# EAGLE design EMGrealPart2w1 (EAGLE 9.3.1)

## Sheet 1 of 2
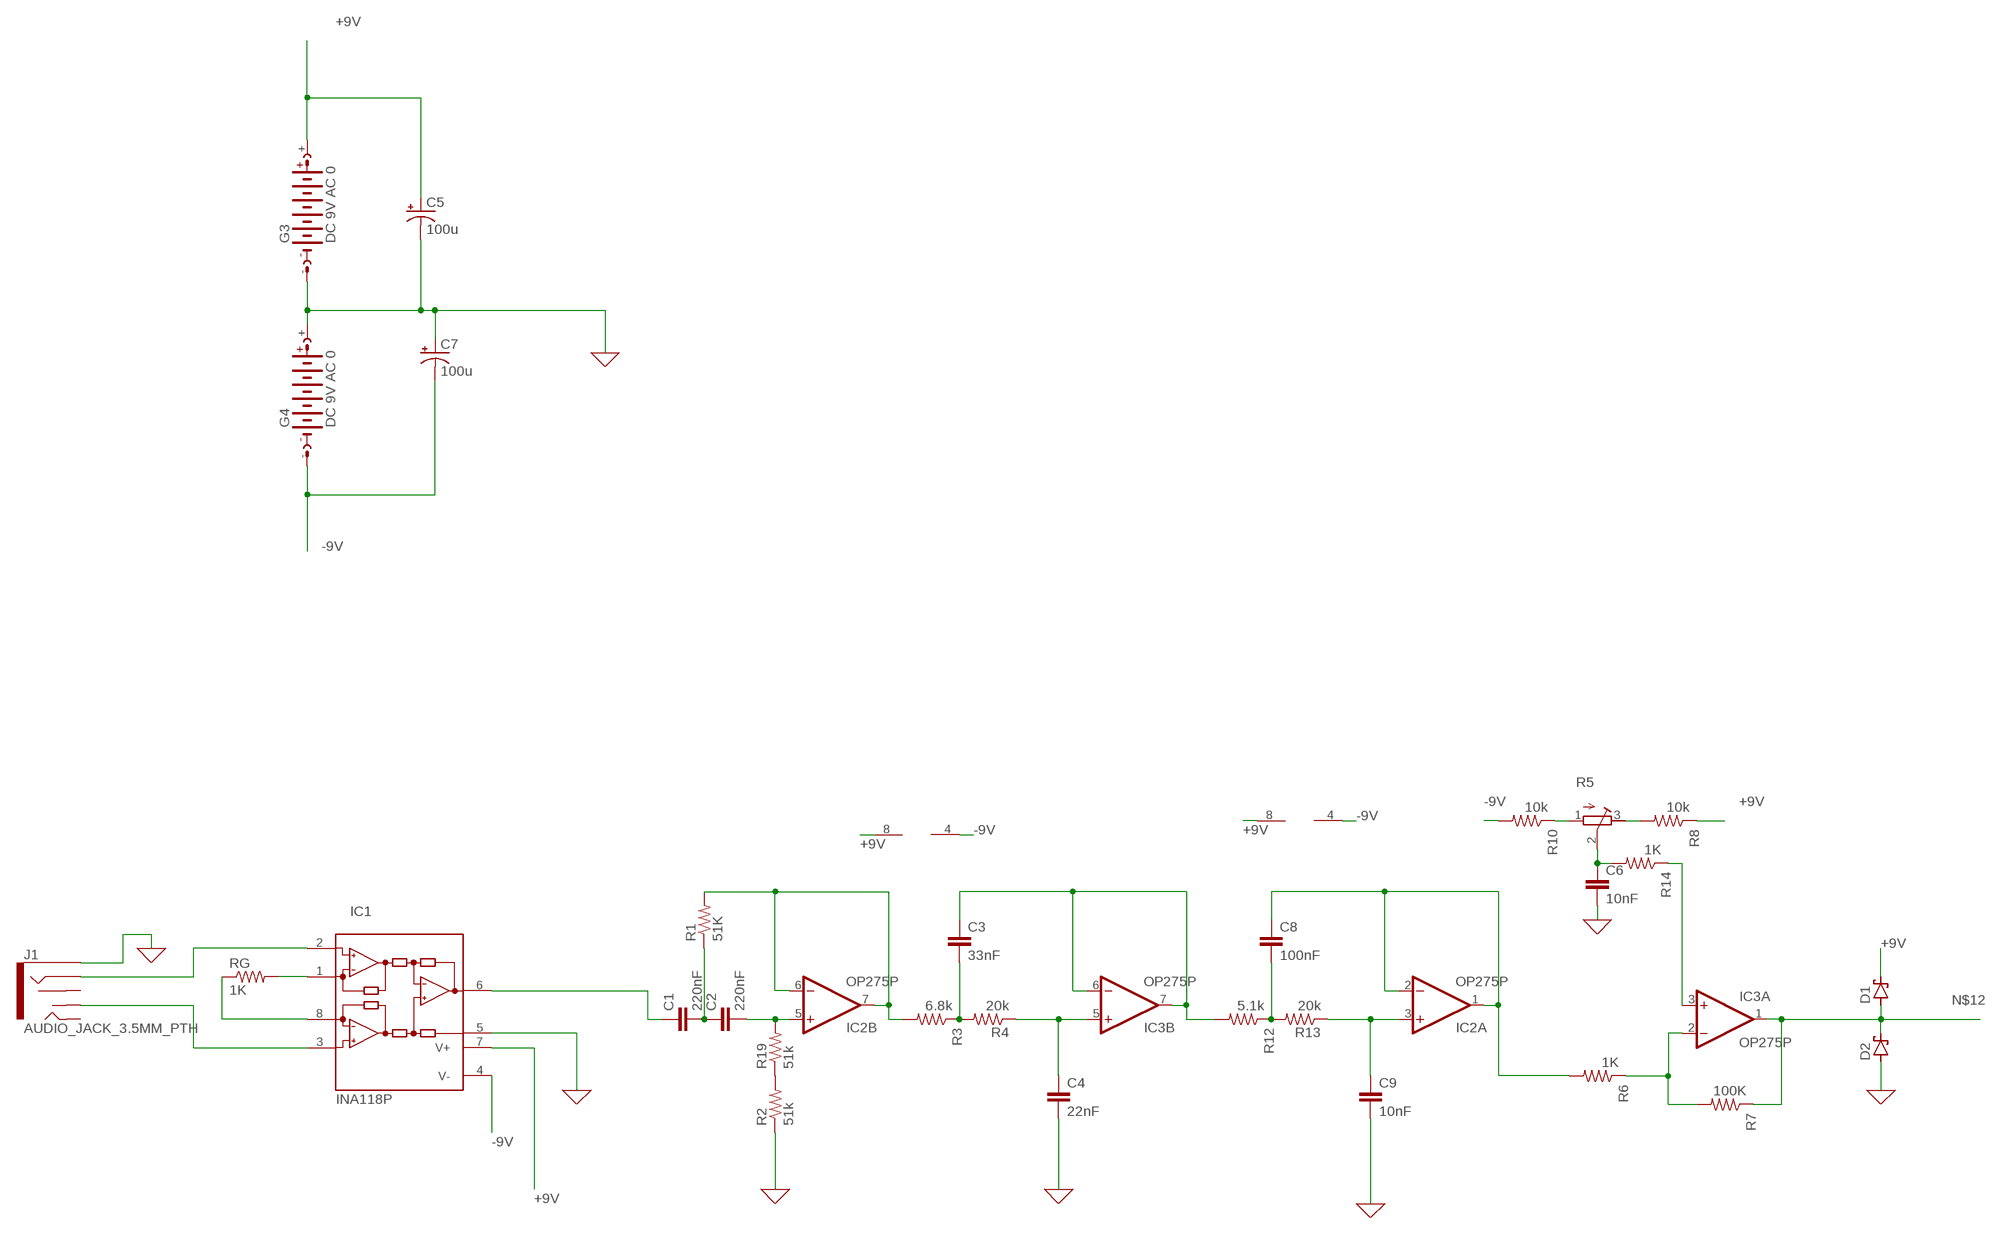
[diagram p0: schematic, sheet 1]

### Parts
C1  220nF  C-EU050-025X075  [C050-025X075]
C2  220nF  C-EU050-025X075  [C050-025X075]
C3  33nF  C-EU050-025X075  [C050-025X075]
C4  22nF  C-EU050-025X075  [C050-025X075]
C5  100u  CPOL-USE2.5-6  [E2,5-6]
C6  10nF  C-EU050-025X075  [C050-025X075]
C7  100u  CPOL-USE2.5-6  [E2,5-6]
C8  100nF  C-EU050-025X075  [C050-025X075]
C9  10nF  C-EU050-025X075  [C050-025X075]
D1  SCHOTTKY-DIODEF126Z12  [F126Z12]
D2  SCHOTTKY-DIODEF126Z12  [F126Z12]
G3  DC 9V AC 0  AB9V  [AB9V]
G4  DC 9V AC 0  AB9V  [AB9V]
IC1  INA118P  [DIL08]
IC2  OP275P  [DIL08]
IC3  OP275P  [DIL08]
J1  AUDIO_JACK_3.5MM_PTH  [AUDIO-JACK]
R1  51K  R-US_0207/12  [0207/12]
R2  51k  R-US_0207/12  [0207/12]
R3  6.8k  R-US_0207/12  [0207/12]
R4  20k  R-US_0207/12  [0207/12]
R5  R-TRIMM64W  [RTRIM64W]
R6  1K  R-US_0207/12  [0207/12]
R7  100K  R-US_0207/12  [0207/12]
R8  10k  R-US_0207/12  [0207/12]
R10  10k  R-US_0207/12  [0207/12]
R12  5.1k  R-US_0207/12  [0207/12]
R13  20k  R-US_0207/12  [0207/12]
R14  1K  R-US_0207/12  [0207/12]
R19  51k  R-US_0207/12  [0207/12]
RG  1K  R-US_0207/12  [0207/12]

### Nets
0: C4.2 C5.- C6.2 C7.+ C9.2 D2.A G3.- G4.+ IC1.5(REF) J1.SLEEVE R2.1 ; supply symbol labelled GND ; also sheet 2
+9V: C5.+ D1.C G3.+ IC1.7(V+) IC2.8(P:V+) IC3.8(P:V+) R8.1 ; also sheet 2
-9V: C7.- G4.- IC1.4(V-) IC2.4(P:V-) IC3.4(P:V-) R10.2
N$1: IC1.1(RG) RG.2
N$2: IC1.8(RG) RG.1
N$3: IC1.2(-IN) J1.RING
N$4: C8.2 R12.1 R13.2
N$5: C1.2 C2.1 R1.1
N$6: C1.1 IC1.6(OUT)
N$7: C2.2 IC2.5(B:+IN) R19.2
N$8: IC2.6(B:-IN) IC2.7(B:OUT) R1.2 R3.2
N$9: C3.2 R3.1 R4.2
N$10: C4.1 IC3.5(B:+IN) R4.1
N$11: C3.1 IC3.6(B:-IN) IC3.7(B:OUT) R12.2
N$12: D1.A D2.C IC3.1(A:OUT) R7.1
N$14: C9.1 IC2.3(A:+IN) R13.1
N$15: R5.1(A) R10.1
N$16: C6.1 R5.2(S) R14.2
N$17: IC3.2(A:-IN) R6.1 R7.2
N$18: R2.2 R19.1
N$19: C8.1 IC2.1(A:OUT) IC2.2(A:-IN) R6.2
N$20: R5.3(E) R8.2
N$25: IC3.3(A:+IN) R14.1
N$26: IC1.3(+IN) J1.TSH
Unconnected: J1.RSH J1.TIP

## Sheet 2 of 2
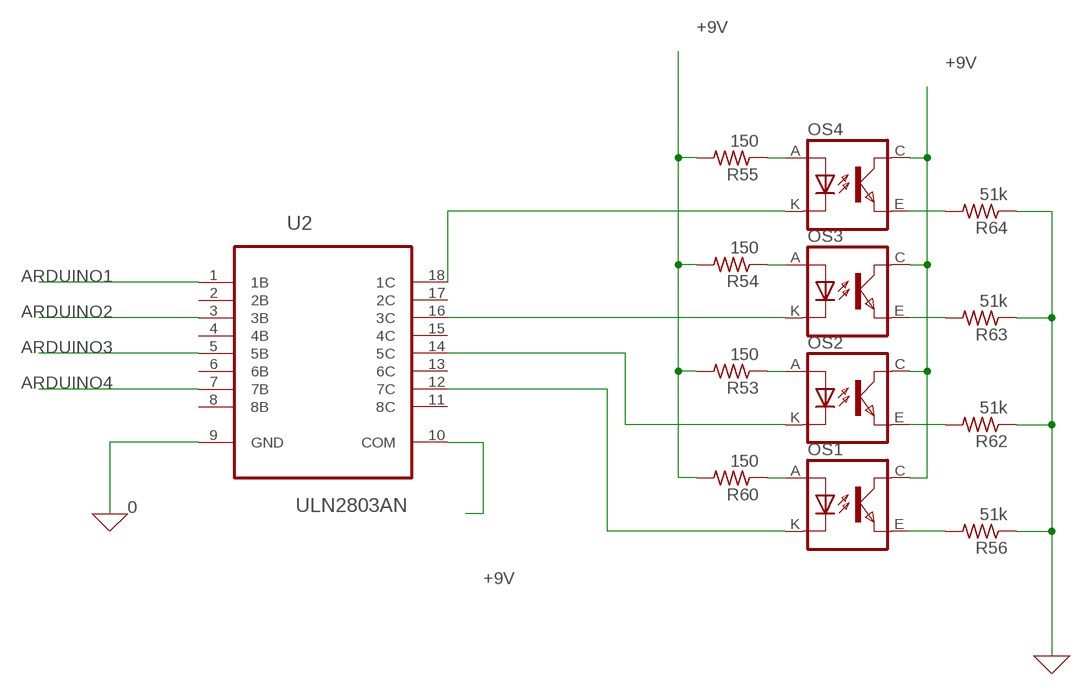
[diagram p1: schematic, sheet 2]

### Parts
OS1  TCRT5000  [TCRT5000]
OS2  TCRT5000  [TCRT5000]
OS3  TCRT5000  [TCRT5000]
OS4  TCRT5000  [TCRT5000]
R53  150  R-US_0207/12  [0207/12]
R54  150  R-US_0207/12  [0207/12]
R55  150  R-US_0207/12  [0207/12]
R56  51k  R-US_0207/12  [0207/12]
R60  150  R-US_0207/12  [0207/12]
R62  51k  R-US_0207/12  [0207/12]
R63  51k  R-US_0207/12  [0207/12]
R64  51k  R-US_0207/12  [0207/12]
U2  ULN2803AN  [DIP254P762X393-18]

### Nets
0: R56.1 R62.1 R63.1 R64.1 U2.9(GND) ; supply symbol labelled GND ; also sheet 1
+9V: OS1.C(COLLECTOR) OS2.C(COLLECTOR) OS3.C(COLLECTOR) OS4.C(COLLECTOR) R53.2 R54.2 R55.2 R60.2 U2.10(COM) ; also sheet 1
ARDUINO1: U2.1(1B)
ARDUINO2: U2.3(3B)
ARDUINO3: U2.5(5B)
ARDUINO4: U2.7(7B)
N$21: OS4.K(CATHODE) U2.18(1C)
N$22: OS3.K(CATHODE) U2.16(3C)
N$23: OS2.K(CATHODE) U2.14(5C)
N$24: OS1.K(CATHODE) U2.12(7C)
N$94: OS1.E(EMITTER) R56.2
N$95: OS2.E(EMITTER) R62.2
N$96: OS3.E(EMITTER) R63.2
N$97: OS4.E(EMITTER) R64.2
N$98: OS4.A(ANODE) R55.1
N$99: OS3.A(ANODE) R54.1
N$100: OS2.A(ANODE) R53.1
N$101: OS1.A(ANODE) R60.1
Unconnected: U2.2(2B) U2.4(4B) U2.6(6B) U2.8(8B) U2.11(8C) U2.13(6C) U2.15(4C) U2.17(2C)

## Library data of the parts
C1-C4 C6 C8 C9 = rcl:C-EU: CAPACITOR, European symbol; SPICEPREFIX: C
C5 C7 = rcl:CPOL-US: POLARIZED CAPACITOR, American symbol; SPICEPREFIX: C
D1 D2 = diode:SCHOTTKY-DIODE: Schottky Diode
G3 G4 = battery:AB9V: 9-V BATTERY CLIP; SPICEPREFIX: V
IC1 = burr-brown:INA118: Instrumentation Amplifier Precision, Low Power; MF: TEXAS INSTRUMENTS; MPN: INA118P; OC_FARNELL: 1470354; OC_NEWARK: 96K4515; SPICEMODEL: INA118a; SPICEPREFIX: X
IC2 IC3 = linear:OP275: Dual Very Low Noise Precision Operational Amplifier Source: http://www.analog.com/static/imported-files/data_sheets/OP270.pdf; SPICEMODEL: OP275p; SPICEPREFIX: X
J1 = SparkFun-Connectors:AUDIO_JACK_3.5MM: Audio Jack 3.5mm variants of PTH and SMT stereo audio jack with bypass switches. SparkFun Products: SparkFun SparkPunk Sound Kit <[https://www.sparkfun.com/products/11177]> - PTH MP3 Trigger <https://www.sparkfun.com/products/13720> -3.5mm SMD SparkFun PicoBoard <https://www.sparkfun.com/products/11888>- 2.5mm SMD; PROD_ID: CONN-08774; SF_ID: PRT-08032
OS1-OS4 = tcrt5000:TCRT5000
R1-R4 R6-R8 R10 R12-R14 R19 R53-R56 R60 R62-R64 RG = rcl:R-US_: RESISTOR, American symbol; SPICEPREFIX: R
R5 = rcl:R-TRIMM: Trimm resistor; SPICEMODEL: X; SPICEPREFIXL: POT
U2 = transistor-arrays:ULN2803AN: Darlington transistor array; MPN: ULN2803AN; OC_FARNELL: 1652422; OC_NEWARK: 21J9298; PACKAGE: DIP-18; SUPPLIER: TEXAS INSTRUMENTS

## Module MO
Ports: OUT(io) IN(io)

### Library data of the parts

## Board
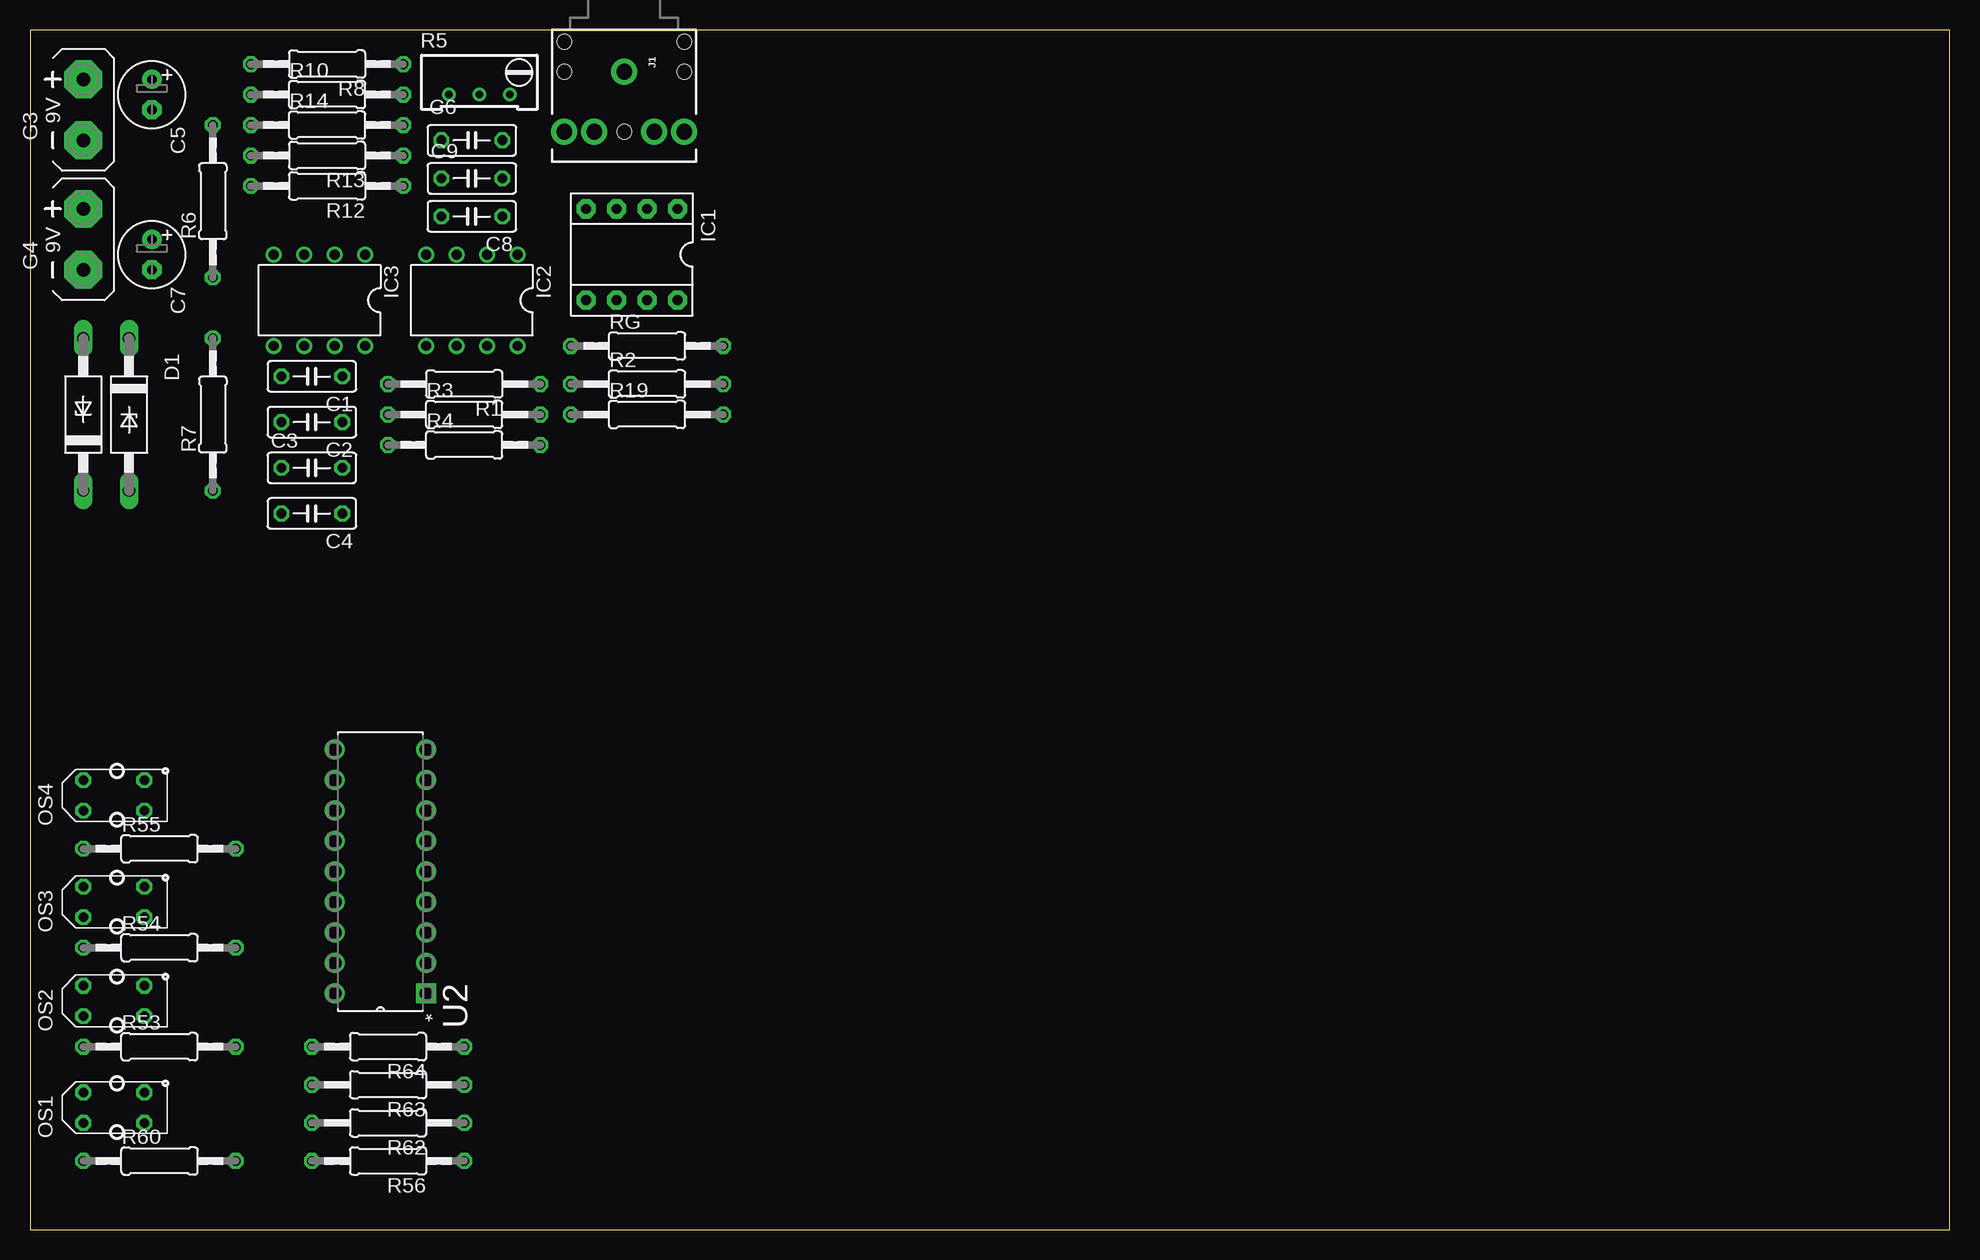
[diagram p2: board, top side]
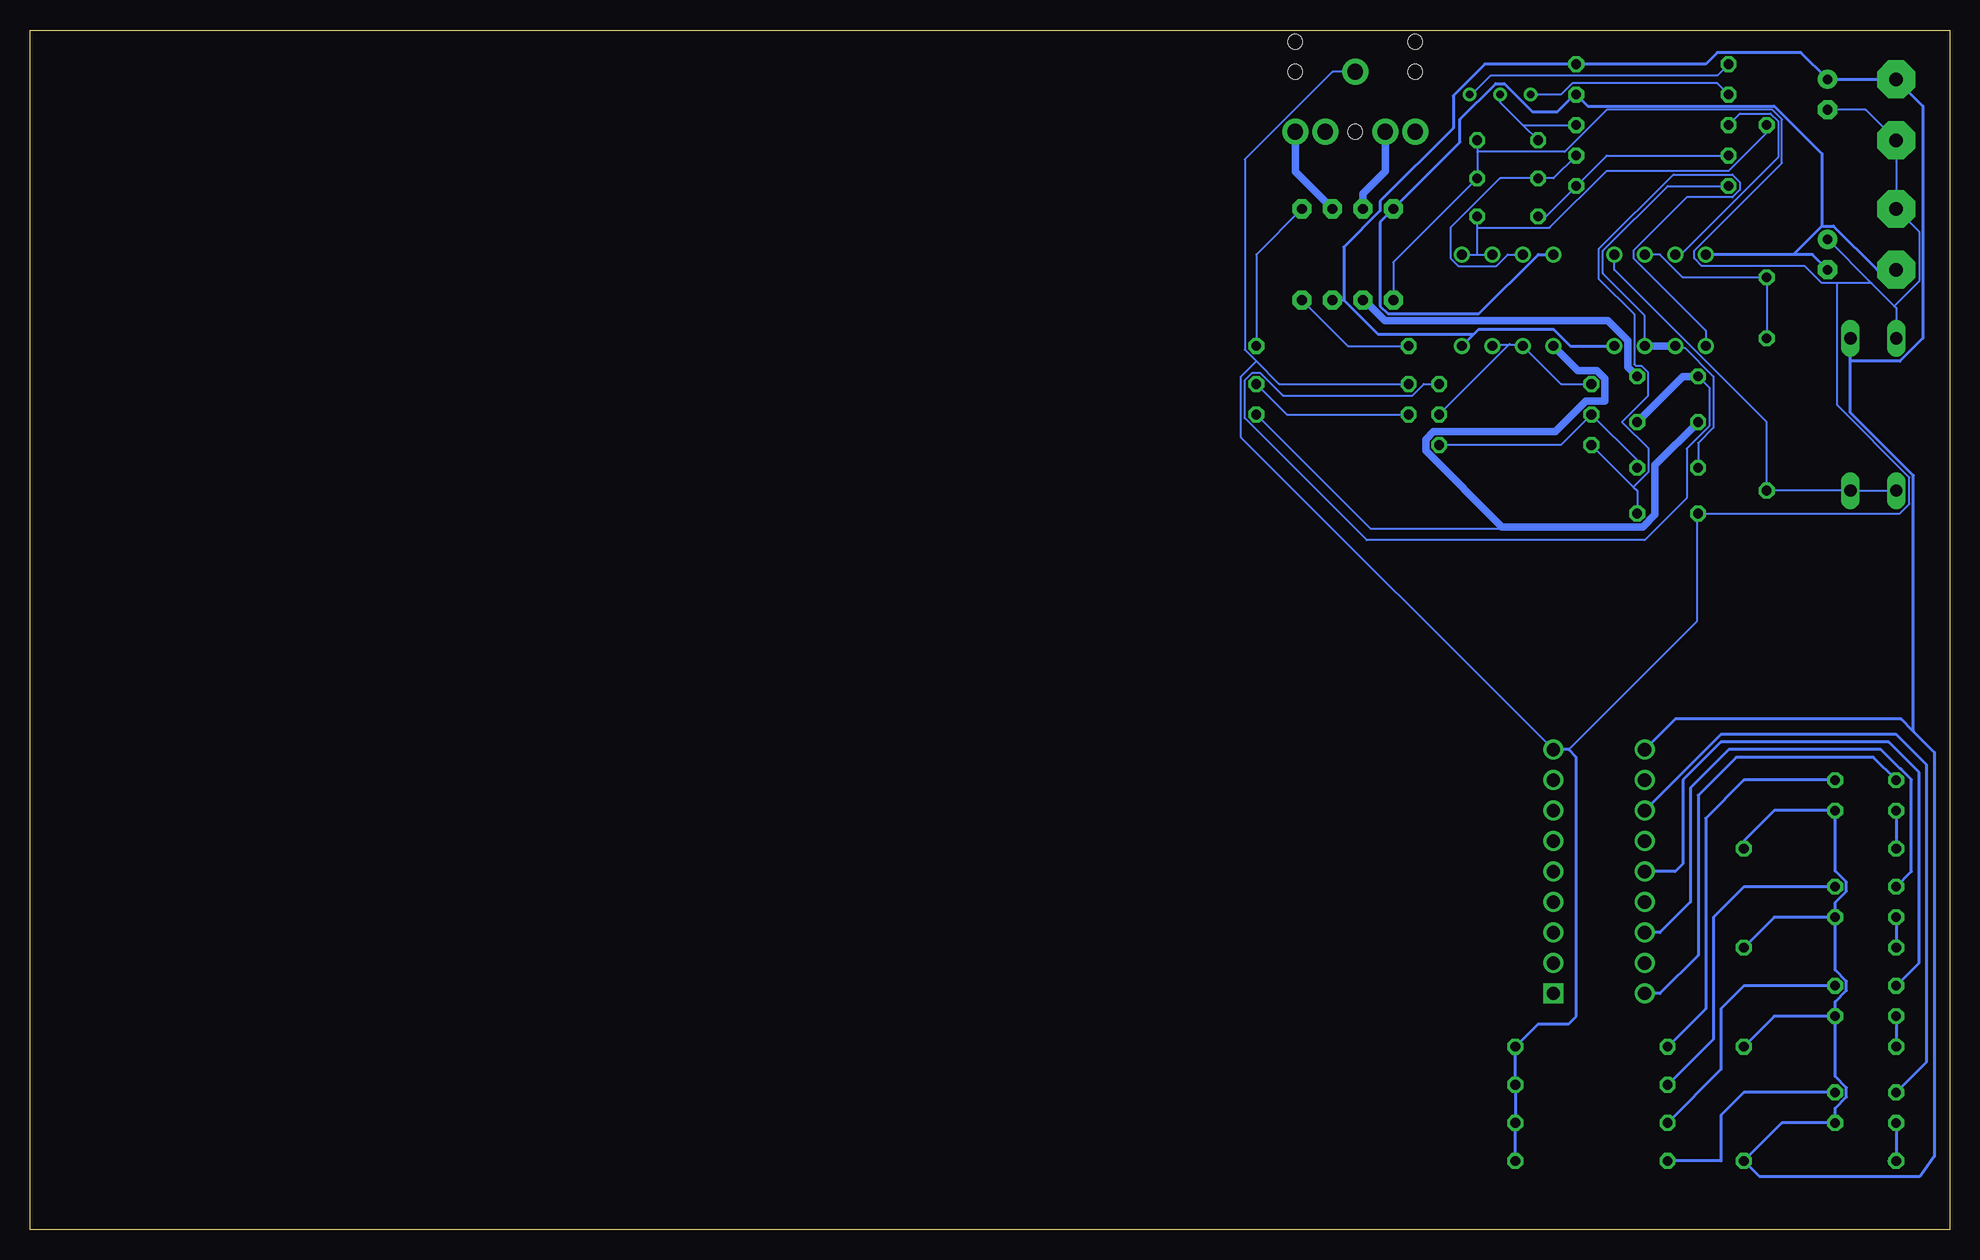
[diagram p3: board, bottom side, seen from below]

Size 160 x 100 mm. Coordinates in mm from the lower left corner, seen from the top.
Outline: 0,0 160,0 160,100 0,100 0,0
Copper layers (1*16): Top 0.035mm / dielectric 1.5mm / Bottom 0.035mm
Design rules "default": minimum track width 6mil, minimum drill 0.35mm, track to track 6mil, track to pad 6mil, pad to pad 6mil, via to via 6mil, smd to smd 6mil, copper to edge 40mil, drill to drill 6mil, minimum pad ring 10mil, minimum via ring 8mil, stop-mask expansion 4mil, vias tented up to drill 0mil, thermal gap 10mil

### Footprints (pad centres in the part's own frame; a part is rotated, then mirrored left to right if it is on the bottom)
C050-025X075 = drill 0.813 octagon: 1 -2.54,0; 2 2.54,0
E2,5-6 = drill 0.813 pad 1.6: + -1.27,0 | drill 0.813 pad 1.6 octagon: - 1.27,0
F126Z12 = drill 1.016 long: A 6.35,0; C -6.35,0
AB9V = drill 1.118 pad 3.15 octagon: + 0,2.54; - 0,-2.54
DIL08 = drill 0.813 pad 1.6 octagon: 1 -3.81,-3.81; 2 -1.27,-3.81; 3 1.27,-3.81; 4 3.81,-3.81; 5 3.81,3.81; 6 1.27,3.81; 7 -1.27,3.81; 8 -3.81,3.81
DIL08' = drill 0.813 pad 1.27: 1 -3.81,-3.81; 2 -1.27,-3.81; 3 1.27,-3.81; 4 3.81,-3.81; 5 3.81,3.81; 6 1.27,3.81; 7 -1.27,3.81; 8 -3.81,3.81
AUDIO-JACK = drill 1.3 pad 2.184: RING 5,5; RSH 5,2.5; SLEEVE 0,0; TIP 5,-5; TSH 5,-2.5 | hole 1.2: 0,5; -2.5,5; -2.5,-5; 0,-5; 5,0
TCRT5000 = drill 0.8 octagon: A -2.54,-1.27; C 2.54,-1.27; E 2.54,1.27; K -2.54,1.27
0207/12 = drill 0.813 octagon: 1 -6.35,0; 2 6.35,0
RTRIM64W = drill 0.61: 1 1.27,-2.54; 2 1.27,0; 3 1.27,2.54
DIP254P762X393-18 = drill 1.118 square: 1 -7.62,20.32 | drill 1.118: 2 -7.62,17.78; 3 -7.62,15.24; 4 -7.62,12.7; 5 -7.62,10.16; 6 -7.62,7.62; 7 -7.62,5.08; 8 -7.62,2.54; 9 -7.62,0; 10 0,0; 11 0,2.54; 12 0,5.08; 13 0,7.62; 14 0,10.16; 15 0,12.7; 16 0,15.24; 17 0,17.78; 18 0,20.32

### Placement (x,y rotation side)
C1  23.5,71.12 180 top
C2  23.5,67.31 180 top
C3  23.5,63.5 0 top
C4  23.5,59.69 180 top
C5  10.16,94.61 270 top
C6  36.83,90.81 0 top
C7  10.16,81.28 270 top
C8  36.83,84.45 180 top
C9  36.83,87.63 0 top
D1  8.26,67.94 270 top
D2  4.45,67.94 90 top
G3  4.45,93.34 0 top
G4  4.45,82.55 0 top
IC1  50.16,81.28 180 top
IC2  OP275P  [DIL08']  36.83,77.47 180 top
IC3  OP275P  [DIL08']  24.13,77.47 180 top
J1  49.53,96.52 270 top
OS1  6.99,10.16 0 top
OS2  6.99,19.05 0 top
OS3  6.99,27.3 0 top
OS4  6.99,36.2 0 top
R1  36.2,70.48 180 top
R2  51.44,70.48 0 top
R3  36.2,67.94 0 top
R4  36.2,65.41 0 top
R5  37.47,95.89 270 top
R6  15.24,85.72 90 top
R7  15.24,67.94 90 top
R8  24.77,97.16 180 top
R10  24.77,94.61 0 top
R12  24.77,87 180 top
R13  24.77,89.53 180 top
R14  24.77,92.08 0 top
R19  51.44,67.94 0 top
R53  10.79,15.24 0 top
R54  10.79,23.5 0 top
R55  10.79,31.75 0 top
R56  29.84,5.71 180 top
R60  10.79,5.71 0 top
R62  29.84,8.89 180 top
R63  29.84,12.06 180 top
R64  29.84,15.24 180 top
RG  51.44,73.66 0 top
U2  25.4,40.01 180 top

### Tracks (layer width: path | path; a pad name or v marks a point on that pad's centre or on a via)
0
  Bottom 0.152: 31.75,40.01 31.7,40.08 21.03,50.75 21.03,59.59 C4.2 4.13,59.69 3.33,60.48 3.33,62.71 9.37,68.74 9.37,78.9 | C6.2 39.37,89.85 | 39.37,89.85 C9.2 46.35,80.64 IC1.5 | D2.A 4.45,76.83 4.6,76.99 | C7.+ 6.51,78.9 | 6.51,78.9 4.6,76.99 | C5.- 6.99,93.34 G3.- G4.+ 2.54,83.19 2.54,79.06 4.6,76.99 | 39.37,89.85 32.07,89.85 28.57,93.34 14.76,93.34 13.97,92.55 13.97,88.9 21.27,81.6 21.27,80.96 20.64,80.33 12.06,80.33 10.64,78.9 9.37,78.9 | 6.51,78.9 9.37,78.9 | R2.1 55.88,70.48 57.78,72.39 | 57.78,72.39 58.74,73.34 58.74,89.22 51.44,96.52 J1.SLEEVE | 57.78,72.39 59.05,71.12 59.05,66.04 U2.9
  Bottom 0.254: R56.1 R62.1 | 36.2,9.53 R62.1 | R62.1 R63.1 R64.1 34.29,17.14 31.75,17.14 31.11,17.78 31.11,39.37 31.75,40.01 U2.9
+9V
  Bottom 0.254: OS2.C 14.61,17.78 R53.2 | OS3.C 14.61,26.04 R54.2 | R55.2 17.14,32.38 14.61,34.92 OS4.C 9.53,29.89 8.59,28.96 8.59,28.19 9.53,27.25 OS3.C | OS2.C 9.53,12.75 8.59,11.82 8.59,11.04 9.53,10.11 OS1.C 13.97,8.89 R60.2 15.88,4.45 2.44,4.45 1.27,6.09 1.27,39.78 3.05,41.56 | OS2.C 9.53,19 8.59,19.93 8.59,20.71 9.53,21.64 OS3.C | 3.05,41.56 4.03,42.55 22.86,42.55 U2.10 | 8.26,72.39 8.26,68.1 3.02,62.87 3.02,41.59 3.05,41.56 | 8.26,72.39 D1.C | IC3.8 31.62,73.66 33.02,75.06 39.24,75.06 39.69,74.61 | IC2.8 39.69,74.61 | 50.48,77.47 IC1.7 | 50.48,77.47 47.62,74.61 39.69,74.61 | 50.48,77.47 50.48,81.92 47.47,84.93 47.47,85.72 41.37,91.82 41.37,94.52 38.73,97.16 R8.1 20.32,97.16 19.37,98.11 12.38,98.11 C5.+ G3.+ 2.22,93.66 2.22,74.3 4.13,72.39 8.26,72.39
-9V
  Bottom 0.254: 13.02,81.28 11.43,81.28 C7.- | 13.02,81.28 IC3.4 | G4.- 6.03,80.01 9.68,83.66 10.64,83.66 | 13.02,81.28 10.64,83.66 | IC2.4 34.29,81.28 39.21,76.36 46.83,76.36 47.47,76.99 47.47,83.98 IC1.4 40.8,90.65 40.8,92.55 37.81,95.54 37.12,95.54 34.77,93.19 32.7,93.19 31.27,94.61 R10.2 30.16,93.66 14.61,93.66 10.64,89.69 10.64,83.66
N$1
  Bottom 0.152: RG.2 57.78,81.28 IC1.1
N$2
  Bottom 0.152: RG.1 50.16,73.66 IC1.8
N$3
  Bottom 0.61: J1.RING 54.53,88.19 IC1.2
N$4
  Bottom 0.152: C8.2 33.66,84.45 R12.1 28.57,89.53 R13.2
N$5
  Bottom 0.152: R1.1 43.81,70.48 44.77,69.53 55.56,69.53 57.47,71.44 58.1,71.44 58.74,70.8 58.74,67.63 48.58,57.47 25.4,57.47 21.91,60.96 21.91,65.09 20,66.99 20,70.17 C1.2
  Bottom 0.61: C1.2 22.23,71.12 C2.1
N$6
  Bottom 0.61: IC1.6 48.77,77.47 47.07,75.78 28.47,75.78 26.82,74.12 26.82,71.91 C1.1
N$7
  Bottom 0.152: R19.2 48.26,58.42 37.45,58.42 37.29,58.57
  Bottom 0.61: IC2.5 30.96,71.6 29.38,71.6 28.73,70.95 28.73,69.06 30.31,69.06 32.85,66.52 43.01,66.52 43.66,65.87 43.66,64.94 37.29,58.57 25.57,58.57 24.55,59.59 24.55,63.72 C2.2
N$8
  Bottom 0.152: 36.67,73.76 38.1,73.76 IC2.7 | 36.67,73.76 35.66,73.76 IC2.6 32.38,70.48 R1.2 | R3.2 36.67,73.82 36.67,73.76
N$9
  Bottom 0.152: C3.2 26.04,64.14 R3.1 32.38,65.41 R4.2
N$10
  Bottom 0.152: C4.1 26.04,61.59 26.35,61.91 | R4.1 26.35,61.91 | IC3.5 20.32,74.93 26.35,80.96 26.35,81.6 21.91,86.04 18.1,86.04 17.46,86.68 17.46,87.31 18.1,87.95 23.02,87.95 29.21,81.76 29.21,79.22 26.29,76.3 26.29,72.14 26.16,72.01 25.67,72.01 25.15,71.49 25.15,69.47 27.3,67.31 25.08,65.09 25.08,63.18 26.35,61.91
N$11
  Bottom 0.152: C3.1 20.95,65.56 19.68,66.83 19.68,71.12 22.07,73.5 22.7,73.5 IC3.6 | R12.2 23.5,87 28.89,81.6 28.89,79.69 25.4,76.2 IC3.7
  Bottom 0.61: IC3.7 IC3.6
N$12
  Bottom 0.152: IC3.1 27.94,80.01 15.24,67.31 R7.1 D1.A D2.C
N$14
  Bottom 0.152: R13.1 33.02,87.63 C9.1 37.47,87.63 41.59,83.5 41.59,80.96 40.96,80.33 37.78,80.33 36.83,81.28 IC2.3
N$15
  Bottom 0.152: R5.1 32.38,94.61 31.43,95.57 19.37,95.57 R10.1
N$16
  Bottom 0.152: R5.2 37.47,93.98 35.56,92.08 | C6.1 35.56,92.08 | 35.56,92.08 R14.2
N$17
  Bottom 0.152: R7.2 R6.1 22.23,79.38 24.13,81.28 IC3.2
N$18
  Bottom 0.152: R19.1 55.24,67.94 R2.2
N$19
  Bottom 0.152: IC2.1 39.37,81.28 | 39.37,81.28 IC2.2 | 39.37,81.28 39.37,83.5 | 39.37,83.5 C8.1 | R6.2 15.24,91.44 18.41,88.27 28.57,88.27 33.34,83.5 39.37,83.5
N$20
  Bottom 0.152: R5.3 39.85,94.61 38.26,96.2 19.37,96.2 R8.2
N$21
  Bottom 0.254: OS4.K 6.35,39.37 17.78,39.37 20.95,36.2 20.95,22.86 24.13,19.68 U2.18
N$22
  Bottom 0.254: OS3.K 3.17,29.84 3.17,37.52 4.06,38.4 4.11,38.4 5.71,40.01 18.41,40.01 21.59,36.83 21.59,27.3 24.13,24.77 U2.16
N$23
  Bottom 0.254: OS2.K 2.54,22.23 2.54,38.1 5.08,40.64 19.05,40.64 22.23,37.47 22.23,30.48 22.86,29.84 U2.14
N$24
  Bottom 0.254: OS1.K 1.91,13.97 1.91,38.73 4.45,41.27 19.05,41.27 U2.12
N$25
  Bottom 0.152: IC3.3 22.38,81.28 14.29,89.38 14.29,92.39 14.92,93.03 17.46,93.03 R14.1
N$26
  Bottom 0.61: J1.TSH 47.03,88.22 48.9,86.36 IC1.3
N$94
  Bottom 0.254: R56.2 19.05,5.71 19.05,9.53 17.14,11.43 OS1.E
N$95
  Bottom 0.254: OS2.E 17.14,20.32 19.05,18.41 19.05,13.34 R62.2
N$96
  Bottom 0.254: OS3.E 17.14,28.57 19.68,26.04 19.68,15.88 R63.2
N$97
  Bottom 0.254: OS4.E 17.14,37.47 20.32,34.29 20.32,18.41 R64.2
N$98
  Bottom 0.254: OS4.A R55.1
N$99
  Bottom 0.254: OS3.A R54.1
N$100
  Bottom 0.254: OS2.A R53.1
N$101
  Bottom 0.152: 4.79,6.01 4.57,5.79 R60.1
  Bottom 0.254: OS1.A 4.45,6.35 4.79,6.01 5.08,5.71